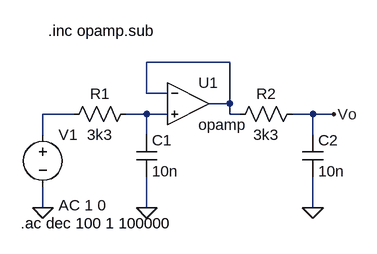
[diagram p0: schematic FiltroAntiAlias.asc]
FiltroAntiAlias.asc, the LTspice schematic file:
Version 4
SHEET 1 880 680
WIRE 256 0 128 0
WIRE 128 48 128 0
WIRE 160 48 128 48
WIRE 256 64 256 0
WIRE 256 64 224 64
WIRE 16 80 -32 80
WIRE 128 80 96 80
WIRE 160 80 128 80
WIRE 256 80 256 64
WIRE 272 80 256 80
WIRE 384 80 352 80
WIRE 416 80 384 80
WIRE -32 112 -32 80
WIRE 128 112 128 80
WIRE 384 112 384 80
WIRE -32 224 -32 192
WIRE 128 224 128 176
WIRE 384 224 384 176
FLAG 128 224 0
FLAG 384 224 0
FLAG 416 80 Vo
FLAG -32 224 0
SYMBOL res 112 64 R90
WINDOW 0 0 56 VBottom 2
WINDOW 3 32 56 VTop 2
SYMATTR InstName R1
SYMATTR Value 3k3
SYMBOL cap 112 112 R0
SYMATTR InstName C1
SYMATTR Value 10n
SYMBOL Opamps\\opamp 192 0 R0
SYMATTR InstName U1
SYMBOL res 368 64 R90
WINDOW 0 0 56 VBottom 2
WINDOW 3 32 56 VTop 2
SYMATTR InstName R2
SYMATTR Value 3k3
SYMBOL cap 368 112 R0
SYMATTR InstName C2
SYMATTR Value 10n
SYMBOL voltage -32 96 R0
WINDOW 123 24 124 Left 2
WINDOW 39 0 0 Left 0
SYMATTR InstName V1
SYMATTR Value ""
SYMATTR Value2 AC 1 0
TEXT -66 248 Left 2 !.ac dec 100 1 100000
TEXT -24 -48 Left 2 !.inc opamp.sub

The netlist it stands for:
* FiltroAntiAlias.asc
R1 N003 N002 3k3
C1 N003 0 10n
XU1 N001 N003 N001 opamp Aol=100K GBW=10Meg  ; pins invin noninvin out
R2 Vo N001 3k3
C2 Vo 0 10n
V1 N002 0 AC 1 0
.ac dec 100 1 100000
.inc opamp.sub
.backanno
.end